# EAGLE design LowVBoard_1.4 (EAGLE 9.6.2)
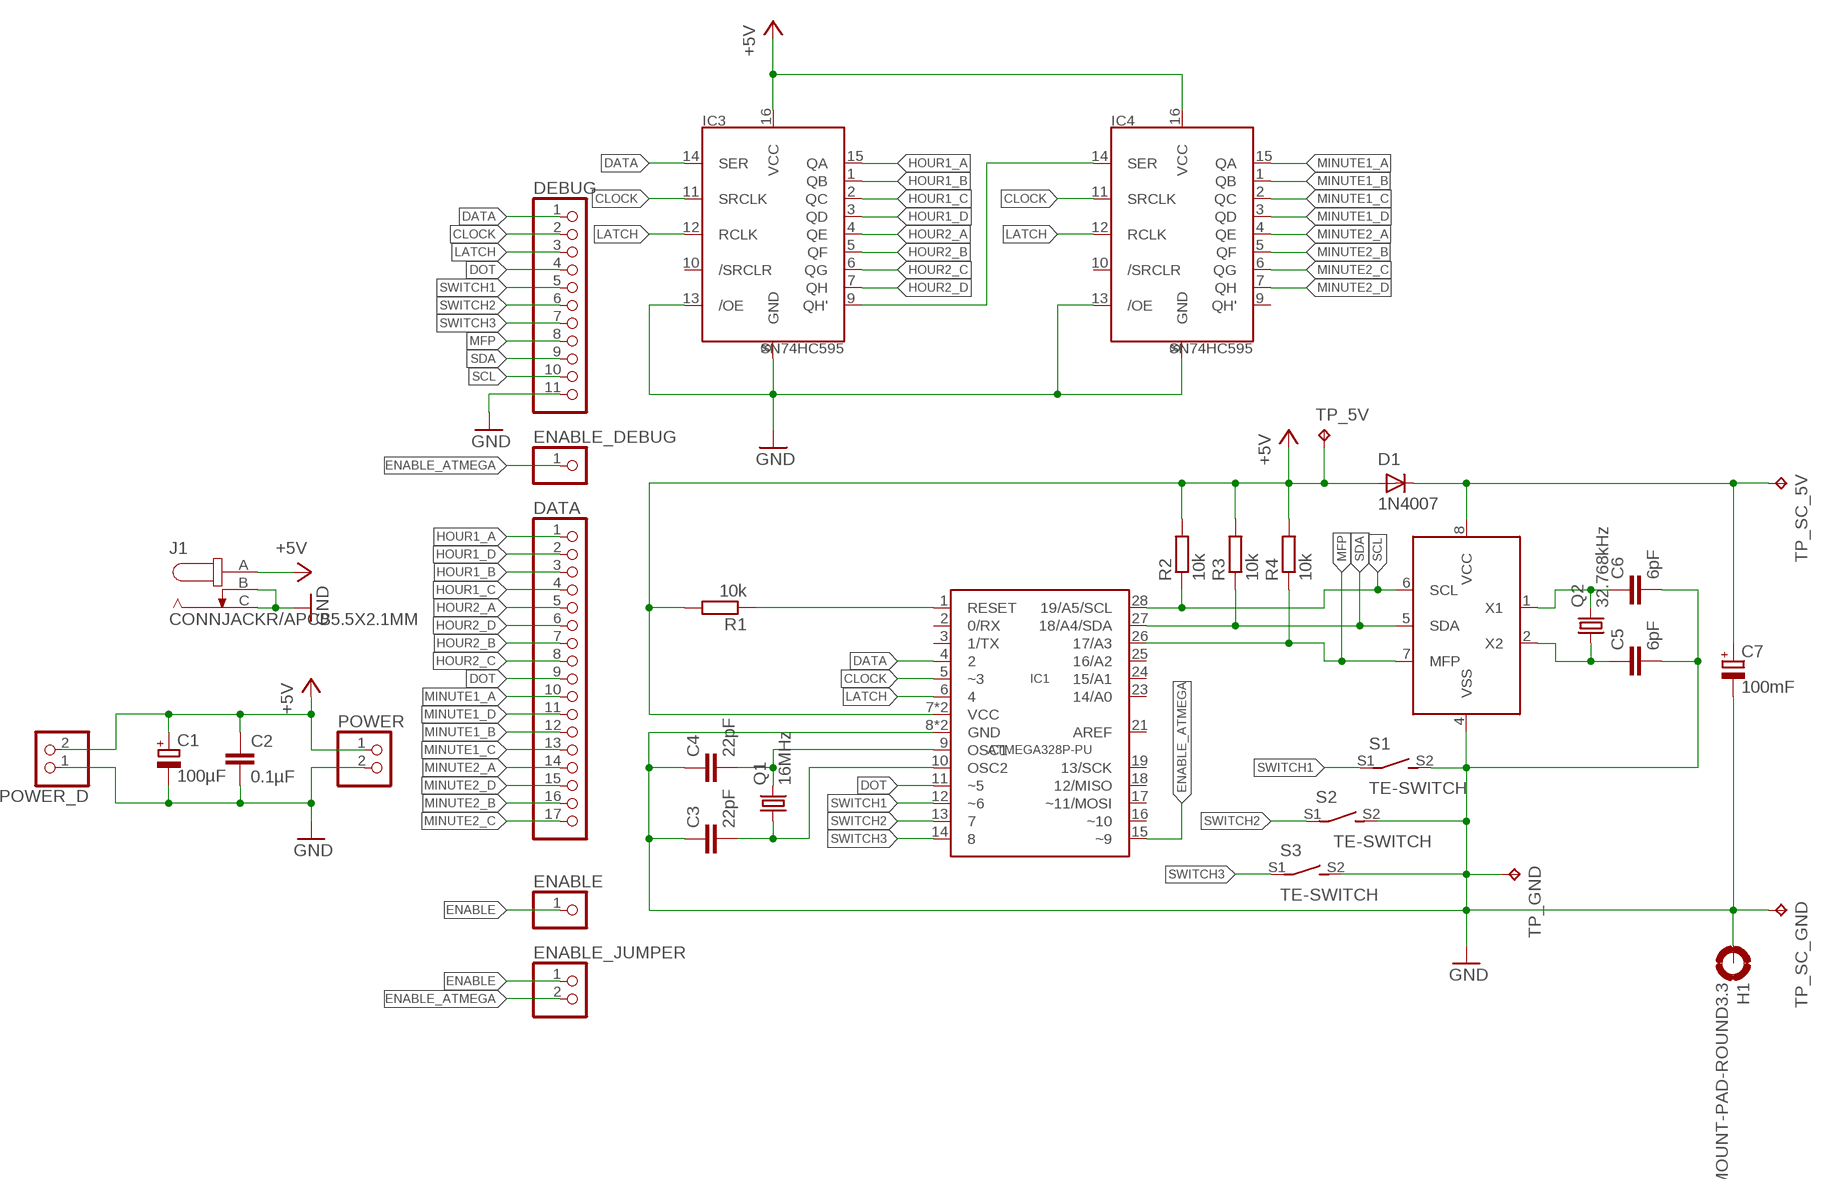
[diagram p0: schematic, sheet 1]

## Parts
C1  100µF  CPOL-EUE2-5  [E2-5]
C2  0.1µF  C-EU025-024X044  [C025-024X044]
C3  22pF  C-EU025-024X044  [C025-024X044]
C4  22pF  C-EU025-024X044  [C025-024X044]
C5  6pF  C-EU025-024X044  [C025-024X044]
C6  6pF  C-EU025-024X044  [C025-024X044]
C7  100mF  FTW0H104ZF  [SUPERCAP-11.5]
D1  1N4007  [DO41-7.6]
DATA  PINHD-1X17  [1X17]
DEBUG  PINHD-1X11/90  [1X11/90]
ENABLE  PINHD-1X1  [1X01]
ENABLE_DEBUG  PINHD-1X1  [1X01]
ENABLE_JUMPER  PINHD-1X2  [1X02]
H1  MOUNT-PAD-ROUND3.3  [3,3-PAD]
IC1  ATMEGA328P-PU  [DIP28]
IC2  MCP7940M  MCP7940M-I/P  [DIL8]
IC3  SN74HC595  [DIL16]
IC4  SN74HC595  [DIL16]
J1  CONNJACKR/APCB5.5X2.1MM  [CONNJACKR/APCB5.5X2.1MM]
POWER  PINHD-1X2  [1X02]
POWER_D  PINHD-1X2/90  [1X02/90]
Q1  16MHz  CRYSTALHC49S  [HC49/S]
Q2  32.768kHz  CFS-206  [CFS-206]
R1  10k  R-EU_0207/7  [0207/7]
R2  10k  R-EU_0207/7  [0207/7]
R3  10k  R-EU_0207/7  [0207/7]
R4  10k  R-EU_0207/7  [0207/7]
S1  TE-SWITCH  [TE-SWITCH]
S2  TE-SWITCH  [TE-SWITCH]
S3  TE-SWITCH  [TE-SWITCH]
TP_5V  TPPAD1-13  [P1-13]
TP_GND  TPPAD1-13  [P1-13]
TP_SC_5V  TPPAD1-13  [P1-13]
TP_SC_GND  TPPAD1-13  [P1-13]

## Nets
+5V [+5V]: C1.+ C2.1 D1.A IC1.7(VCC) IC1.20(VCC) IC3.16(VCC) IC4.16(VCC) J1.A POWER.1 POWER_D.2 R1.2 R2.2 R3.2 R4.2 TP_5V.TP
CLOCK: DEBUG.2 IC1.5(~3) IC3.11(SRCLK) IC4.11(SRCLK)
DATA: DEBUG.1 IC1.4 IC3.14(SER)
DOT: DATA.9 DEBUG.4 IC1.11(~5)
ENABLE: ENABLE.1 ENABLE_JUMPER.1
ENABLE_ATMEGA: ENABLE_DEBUG.1 ENABLE_JUMPER.2 IC1.15(~9)
GND [GND]: C1.- C2.2 C3.1 C4.1 C5.2 C6.2 C7.- DEBUG.11 H1.B3,3(MOUNT) IC1.8(GND) IC1.22(GND) IC2.4(VSS) IC3.8(GND) IC3.13(/OE) IC4.8(GND) IC4.13(/OE) J1.B J1.C POWER.2 POWER_D.1 S1.S2(S) S2.S2(S) S3.S2(S) TP_GND.TP TP_SC_GND.TP
HOUR1_A: DATA.1 IC3.15(QA)
HOUR1_B: DATA.3 IC3.1(QB)
HOUR1_C: DATA.4 IC3.2(QC)
HOUR1_D: DATA.2 IC3.3(QD)
HOUR2_A: DATA.5 IC3.4(QE)
HOUR2_B: DATA.7 IC3.5(QF)
HOUR2_C: DATA.8 IC3.6(QG)
HOUR2_D: DATA.6 IC3.7(QH)
LATCH: DEBUG.3 IC1.6 IC3.12(RCLK) IC4.12(RCLK)
MFP: DEBUG.8 IC1.26(17/A3) IC2.7(MFP) R4.1
MINUTE1_A: DATA.10 IC4.15(QA)
MINUTE1_B: DATA.12 IC4.1(QB)
MINUTE1_C: DATA.13 IC4.2(QC)
MINUTE1_D: DATA.11 IC4.3(QD)
MINUTE2_A: DATA.14 IC4.4(QE)
MINUTE2_B: DATA.16 IC4.5(QF)
MINUTE2_C: DATA.17 IC4.6(QG)
MINUTE2_D: DATA.15 IC4.7(QH)
N$1: C7.+ D1.C IC2.8(VCC) TP_SC_5V.TP
N$53: C4.2 IC1.9(OSC1) Q1.2
N$54: C3.2 IC1.10(OSC2) Q1.1
N$56: IC1.1(RESET) R1.1
N$60: C6.1 IC2.1(X1) Q2.P$2
N$61: C5.1 IC2.2(X2) Q2.P$1
N$69: IC3.9(QH') IC4.14(SER)
SCL: DEBUG.10 IC1.28(19/A5/SCL) IC2.6(SCL) R2.1
SDA: DEBUG.9 IC1.27(18/A4/SDA) IC2.5(SDA) R3.1
SWITCH1: DEBUG.5 IC1.12(~6) S1.S1(P)
SWITCH2: DEBUG.6 IC1.13 S2.S1(P)
SWITCH3: DEBUG.7 IC1.14 S3.S1(P)
Unconnected: IC1.2(0/RX) IC1.3(1/TX) IC1.16(~10) IC1.17(~11/MOSI) IC1.18(12/MISO) IC1.19(13/SCK) IC1.21(AREF) IC1.23(14/A0) IC1.24(15/A1) IC1.25(16/A2) IC3.10(/SRCLR) IC4.9(QH') IC4.10(/SRCLR)

## Library data of the parts
C1 = resistor:CPOL-EU: POLARIZED CAPACITOR, European symbol
C2-C6 = resistor:C-EU: CAPACITOR, European symbol
C7 = Nixie:FTW0H104ZF
D1 = Nixie:1N4007
DATA = pinhead:PINHD-1X17: PIN HEADER
DEBUG = pinhead:PINHD-1X11: PIN HEADER
ENABLE ENABLE_DEBUG = pinhead:PINHD-1X1: PIN HEADER
ENABLE_JUMPER POWER POWER_D = pinhead:PINHD-1X2: PIN HEADER
H1 = holes:MOUNT-PAD-ROUND: MOUNTING PAD, round
IC1 = Programmer:ATMEGA328P-PU
IC2 = Nixie:MCP7940M-I/P
IC3 IC4 = Nixie:SN74HC595
J1 = Nixie:CONNJACKR/APCB5.5X2.1MM
Q1 = crystal:CRYSTAL: CRYSTAL; OC_FARNELL: 1667008; OC_NEWARK: unknown
Q2 = Nixie:CFS-206
R1-R4 = resistor:R-EU_: RESISTOR, European symbol
S1-S3 = Nixie:TE-SWITCH
TP_5V TP_GND TP_SC_5V TP_SC_GND = testpad:TP: Test pad

## Net classes
0 SIGNAL: width 0.203 mm, clearance 0.203 mm
1 +5V: width 0.406 mm, clearance 0.203 mm
2 GND: clearance 0.203 mm

## Board
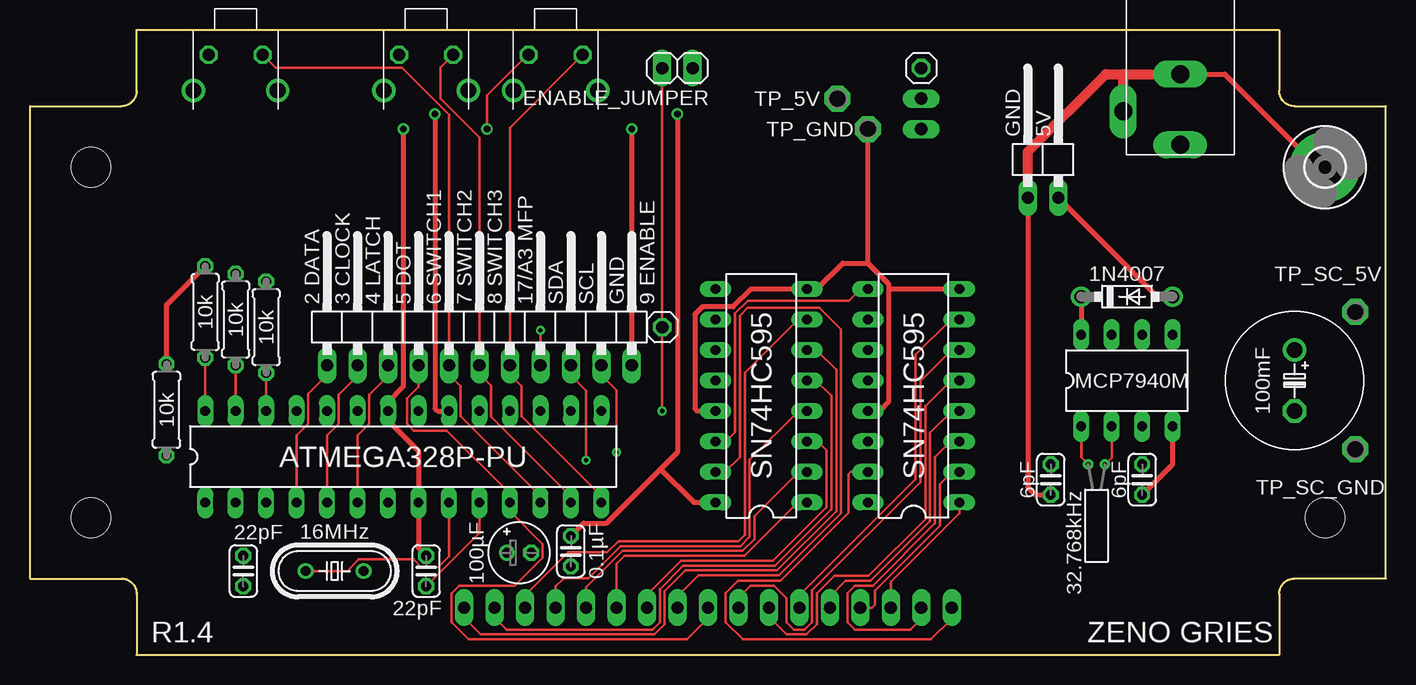
[diagram p1: board, top side]
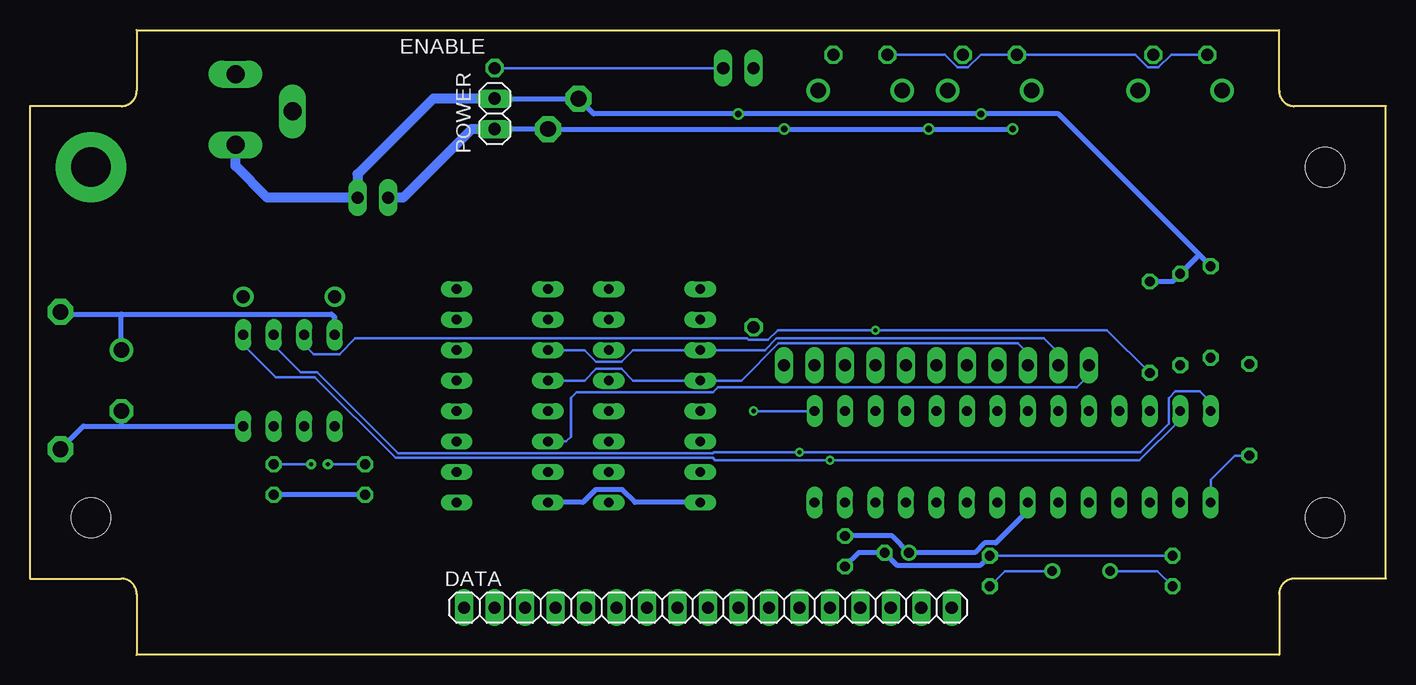
[diagram p2: board, bottom side, seen from below]

Size 113.03 x 52.07 mm. Coordinates in mm from the lower left corner, seen from the top.
Outline: 0,6.35 0,45.72 7.62,45.72 arc90 8.89,46.99 8.89,52.07 104.14,52.07 104.14,46.99 arc90 105.41,45.72 113.03,45.72 113.03,6.35 105.41,6.35 arc90 104.14,5.08 104.14,0 8.89,0 8.89,5.08 arc90 7.62,6.35 0,6.35
Copper layers (1*16): Top 0.035mm / dielectric 1.5mm / Bottom 0.035mm
Design rules "default *": minimum track width 6mil, minimum drill 0.35mm, track to track 6mil, track to pad 6mil, pad to pad 6mil, via to via 6mil, smd to smd 6mil, copper to edge 40mil, drill to drill 6mil, minimum pad ring 10mil, minimum via ring 8mil, stop-mask expansion 4mil, vias tented up to drill 14mil, thermal gap 10mil
Holes 3.3 mm at 5.08,40.64 5.08,11.43 107.95,11.43

### Footprints (pad centres in the part's own frame; a part is rotated, then mirrored left to right if it is on the bottom)
E2-5 = drill 0.813 pad 1.27: + -1.016,0 | drill 0.813 pad 1.27 octagon: - 1.016,0
C025-024X044 = drill 0.813 octagon: 1 -1.27,0; 2 1.27,0
SUPERCAP-11.5 = drill 1.3: + -2.54,0 | drill 1.3 octagon: - 2.54,0
DO41-7.6 = drill 1.1 pad 1.7: A 3.81,0; C -3.81,0
1X17 = drill 1.016 long: 1 -20.32,0; 2 -17.78,0; 3 -15.24,0; 4 -12.7,0; 5 -10.16,0; 6 -7.62,0; 7 -5.08,0; 8 -2.54,0; 9 0,0; 10 2.54,0; 11 5.08,0; 12 7.62,0; 13 10.16,0; 14 12.7,0; 15 15.24,0; 16 17.78,0; 17 20.32,0
1X11/90 = drill 1.016 long: 1 -12.7,-3.81; 2 -10.16,-3.81; 3 -7.62,-3.81; 4 -5.08,-3.81; 5 -2.54,-3.81; 6 0,-3.81; 7 2.54,-3.81; 8 5.08,-3.81; 9 7.62,-3.81; 10 10.16,-3.81; 11 12.7,-3.81
1X01 = drill 1.016 octagon: 1 0,0
1X02 = drill 1.016 long: 1 -1.27,0; 2 1.27,0
3,3-PAD = drill 3.3 pad 5.842: B3,3 0,0
DIP28 = drill 0.813 long: 1 -16.51,-3.81; 2 -13.97,-3.81; 3 -11.43,-3.81; 4 -8.89,-3.81; 5 -6.35,-3.81; 6 -3.81,-3.81; 7 -1.27,-3.81; 8 1.27,-3.81; 9 3.81,-3.81; 10 6.35,-3.81; 11 8.89,-3.81; 12 11.43,-3.81; 13 13.97,-3.81; 14 16.51,-3.81; 15 16.51,3.81; 16 13.97,3.81; 17 11.43,3.81; 18 8.89,3.81; 19 6.35,3.81; 20 3.81,3.81; 21 1.27,3.81; 22 -1.27,3.81; 23 -3.81,3.81; 24 -6.35,3.81; 25 -8.89,3.81; 26 -11.43,3.81; 27 -13.97,3.81; 28 -16.51,3.81
DIL8 = drill 0.813 long: 1 -3.81,-3.81; 2 -1.27,-3.81; 3 1.27,-3.81; 4 3.81,-3.81; 5 3.81,3.81; 6 1.27,3.81; 7 -1.27,3.81; 8 -3.81,3.81
DIL16 = drill 0.813 long: 1 -8.89,-3.81; 2 -6.35,-3.81; 3 -3.81,-3.81; 4 -1.27,-3.81; 5 1.27,-3.81; 6 3.81,-3.81; 7 6.35,-3.81; 8 8.89,-3.81; 9 8.89,3.81; 10 6.35,3.81; 11 3.81,3.81; 12 1.27,3.81; 13 -1.27,3.81; 14 -3.81,3.81; 15 -6.35,3.81; 16 -8.89,3.81
CONNJACKR/APCB5.5X2.1MM = drill 1.5 long: A 0,6.4; B 0,0.5; C 4.75,3.6
1X02/90 = drill 1.016 long: 1 -1.27,-3.81; 2 1.27,-3.81
HC49/S = drill 0.813: 1 -2.413,0; 2 2.413,0
CFS-206 = drill 0.35: P$1 0,-0.7; P$2 0,0.7
0207/7 = drill 0.813 octagon: 1 -3.81,0; 2 3.81,0
TE-SWITCH = drill 1.3: A1 -3.505,1.49; A2 3.505,1.49 | drill 0.99 octagon: S1 -2.25,-1.49; S2 2.25,-1.49
P1-13 = drill 1.321 pad 2.159 octagon: TP 0,0

### Placement (x,y rotation side)
C1  40.77,8.51 0 top
C2  45.09,8.64 270 top
C3  33.02,6.99 270 top
C4  17.78,6.99 270 top
C5  92.71,14.61 270 top
C6  85.09,14.61 270 top
C7  105.41,22.86 270 top
D1  91.44,29.84 0 top
DATA  56.52,3.94 0 bottom
DEBUG  37.47,27.94 0 top
ENABLE  74.3,48.9 0 top
ENABLE_DEBUG  52.7,27.3 0 top
ENABLE_JUMPER  53.98,48.9 180 top
H1  107.95,40.64 0 top
IC1  31.11,16.51 0 top
IC2  91.44,22.86 0 top
IC3  73.66,21.59 90 top
IC4  60.96,21.59 90 top
J1  95.89,48.9 180 top
POWER  74.3,45.09 270 bottom
POWER_D  84.45,41.91 0 top
Q1  25.4,6.99 180 top
Q2  88.9,15.88 90 top
R1  11.38,20.42 90 top
R2  14.61,28.57 90 top
R3  17.14,27.94 90 top
R4  19.68,27.3 90 top
S1  17.14,48.51 180 top
S2  33.02,48.51 180 top
S3  43.81,48.51 180 top
TP_5V  67.31,46.35 0 top
TP_GND  69.85,43.81 0 top
TP_SC_5V  110.49,28.57 0 top
TP_SC_GND  110.49,17.14 0 top

### Tracks (layer width: path | path; a pad name or v marks a point on that pad's centre or on a via)
+5V  (via drill 0.55)
  Top 0.406: IC1.20 33.98,20.32 33.76,20.55 v33.76,45.09 | R1.2 11.38,29.16 R2.2 | POWER_D.2 93.98,29.84 D1.A | v53.98,45.09 53.98,16.88 52.57,15.48 | IC4.16 55.35,12.7 52.57,15.48 | C2.1 46.15,10.97 48.07,10.97 52.57,15.48
  Bottom 0.406: POWER.1 TP_5V.TP 66.04,45.09 v53.98,45.09 v33.76,45.09 27.3,45.09 15.56,33.34 | R2.2 15.56,33.34 | R4.2 17.78,31.11 R3.2 15.56,33.34 | IC1.7 29.84,11.99 32.51,9.32 33.46,9.32 34.27,8.51 C1.+ 41.15,9.91 C2.1 | IC4.16 62.6,12.7 63.67,13.77 65.87,13.77 66.94,12.7 IC3.16
  Bottom 0.813: J1.A 95.89,40.74 93.24,38.1 POWER_D.2 85.72,40.06 79.43,46.35 POWER.1
CLOCK
  Top 0.203: IC1.5 24.77,18.3 25.73,19.26 25.73,21.69 27.3,23.27 DEBUG.2
  Bottom 0.203: DEBUG.2 27.3,25.18 28.49,26.36 50.79,26.36 51.76,25.4 IC4.11 62.74,25.4 63.71,24.43 65.84,24.43 66.8,25.4 IC3.11
DATA
  Top 0.203: IC1.4 22.23,18.3 23.19,19.26 23.19,21.77 24.77,23.34 DEBUG.1
  Bottom 0.203: DEBUG.1 24.77,23.31 25.77,22.3 55.67,22.3 56.07,21.89 67.49,21.89 67.94,21.44 67.94,18.16 68.33,17.78 IC3.14
DOT
  Top 0.203: DEBUG.4 32.38,22.34 31.42,21.38 31.42,19.26 31.98,18.69 34.75,18.69 40.01,13.44 IC1.11 40.01,11.96 42.75,9.22 42.75,8.11 40.41,5.77 35.75,5.77 35.13,5.14 35.13,2.73 36.57,1.29 54.77,1.29 56.52,3.04 DATA.9
ENABLE
  Bottom 0.203: ENABLE_JUMPER.1 ENABLE.1
ENABLE_ATMEGA  (via drill 0.35)
  Top 0.203: v52.7,20.32 ENABLE_DEBUG.1 ENABLE_JUMPER.2
  Bottom 0.203: IC1.15 v52.7,20.32
GND  (via drill 0.55)
  Top 0.203: S3.S2 41.48,50.01 38.1,46.62 v38.1,43.81
  Top 0.406: H1.B3,3 107.34,40.64 99.59,48.4 J1.B | v31.11,43.81 31.11,22.38 29.84,21.11 IC1.22 29.84,19.51 32.38,16.97 IC1.8 32.38,8.89 C3.1 | POWER_D.1 83.19,13.97 83.82,13.34 C6.2 | C5.2 95.25,15.88 IC2.4 | 69.85,32.65 71.58,30.92 71.58,30.48 | IC3.13 70.8,20.32 71.58,21.1 71.58,30.48 | IC4.13 55.64,20.32 55.42,20.54 55.42,28.38 56.05,29.01 58.62,29.01 60.09,30.48 IC4.8 65.58,30.48 67.75,32.65 69.85,32.65 | IC3.8 71.58,30.48 | 69.85,32.65 TP_GND.TP | v50.16,43.81 DEBUG.11 | 91.14,48.4
  Top 0.813: POWER_D.1 83.19,41.91 89.67,48.4 91.14,48.4 | 91.14,48.4 J1.B | J1.C 91.14,48.4
  Bottom 0.203: S1.S2 17.91,50.01 18.96,48.95 19.83,48.95 20.89,50.01 S2.S2 33.78,50.01 34.83,48.95 35.71,48.95 36.76,50.01 S3.S2 | C3.1 C4.1
  Bottom 0.406: POWER.2 TP_GND.TP v50.16,43.81 v38.1,43.81 v31.11,43.81 | C2.2 43.94,8.51 C1.- 40.72,7.44 33.84,7.44 33.03,8.26 C3.1 | C6.2 C5.2 | TP_SC_GND.TP 108.58,19.05 105.41,19.05 | 105.41,19.05 IC2.4 | C7.- 105.41,19.05
  Bottom 0.813: POWER.2 76.22,43.81 81.94,38.1 POWER_D.1
HOUR1_A
  Top 0.203: IC3.15 68.43,15.24 68.22,15.03 68.22,11.83 62.57,6.17 59.02,6.17 57.99,5.14 57.99,2.73 59.43,1.29 75.12,1.29 76.83,3.01 DATA.1
HOUR1_B
  Top 0.203: DATA.3 71.75,6.07 77.47,11.79 IC3.1
HOUR1_C
  Top 0.203: IC3.2 76.86,15.24 75.84,14.22 75.84,10.76 70.43,5.35 70.43,4.19 70.18,3.94 DATA.4
HOUR1_D
  Top 0.203: IC3.3 76.76,17.78 75.44,16.46 75.44,10.95 70.26,5.77 68.77,5.77 68.15,5.14 68.15,2.73 68.77,2.11 73.41,2.11 74.3,3 DATA.2
HOUR2_A
  Top 0.203: IC3.4 76.86,20.32 75.03,18.49 75.03,11.12 70.08,6.17 68,6.17 66.67,4.85 DATA.5
HOUR2_B
  Top 0.203: IC3.5 76.78,22.86 74.62,20.7 74.62,11.3 69.9,6.58 67.05,6.58 65.61,5.14 65.61,2.56 64.75,1.7 63.07,1.7 61.59,3.17 DATA.7
HOUR2_C
  Top 0.203: IC3.6 76.81,25.4 74.22,22.81 74.22,14.39 65.2,5.37 65.2,2.73 64.58,2.11 63.69,2.11 63.07,2.73 63.07,4.73 62.04,5.77 60.07,5.77 59.05,4.75 DATA.8
HOUR2_D
  Top 0.203: IC3.7 76.76,27.94 73.81,24.99 73.81,14.63 64.14,4.95 DATA.6
LATCH
  Top 0.203: IC1.6 27.3,18.3 28.27,19.26 28.27,21.69 29.84,23.27 DEBUG.3
  Bottom 0.203: DEBUG.3 29.84,25.13 30.67,25.96 50.62,25.96 53.72,22.86 IC4.12 62.74,22.86 63.71,23.82 65.83,23.82 66.8,22.86 IC3.12
MFP  (via drill 0.35)
  Top 0.203: IC1.26 R4.1 | v42.55,27.05 DEBUG.8
  Bottom 0.203: R4.1 23.24,27.05 v42.55,27.05 50.68,27.05 51.49,26.24 53.15,26.24 53.27,26.36 85.91,26.36 87.23,25.04 89.38,25.04 90.17,25.83 IC2.7
MINUTE1_A
  Top 0.203: DATA.10 53.98,4.88 55.73,6.63 62.45,6.63 67.61,11.79 67.61,27.12 65.83,28.91 59.82,28.91 59.18,28.26 59.18,16.48 57.94,15.24 IC4.15
MINUTE1_B
  Top 0.203: DATA.12 48.9,7.59 49.55,8.26 59.58,8.26 64.02,12.7 IC4.1
MINUTE1_C
  Top 0.203: IC4.2 64.11,15.24 60.4,11.53 60.4,9.65 59.41,8.66 49.39,8.66 46.35,5.63 DATA.13
MINUTE1_D
  Top 0.203: IC4.3 65.68,17.78 66.4,17.06 66.4,12.3 61.94,7.85 54.28,7.85 51.44,5 DATA.11
MINUTE2_A
  Top 0.203: IC4.4 64.06,20.32 59.99,16.26 59.99,9.83 59.23,9.07 49.22,9.07 46.55,6.4 44.5,6.4 43.81,5.71 DATA.14
MINUTE2_B
  Top 0.203: IC4.5 65.53,22.86 66.8,21.58 66.8,12.13 62.11,7.44 54.46,7.44 52.5,5.49 52.5,2.73 51.88,2.11 39.72,2.11 38.73,3.09 DATA.16
MINUTE2_C
  Top 0.203: DATA.17 36.2,3.09 37.58,1.7 52.05,1.7 52.91,2.56 52.91,5.32 54.63,7.04 62.28,7.04 67.21,11.96 67.21,23.74 65.55,25.4 IC4.6
MINUTE2_D
  Top 0.203: IC4.7 64.03,27.94 59.59,23.5 59.59,10.01 59.05,9.47 49.05,9.47 48.11,8.53 44.85,8.53 41.27,4.96 DATA.15
N$1
  Top 0.406: D1.C IC2.8
  Bottom 0.406: IC2.8 87.63,28.13 87.9,28.4 105.41,28.4 | TP_SC_5V.TP 110.31,28.4 105.41,28.4 | C7.+ 105.41,28.4
N$53
  Top 0.203: Q1.2 26.45,6.99 27.41,7.95 31.96,7.95 32.62,7.29 34,7.29 34.92,8.21 IC1.9
  Bottom 0.203: C4.2 19.05,6.99 Q1.2
N$54
  Top 0.203: C3.2 37.47,10.16 IC1.10
  Bottom 0.203: Q1.1 31.75,6.99 C3.2
N$56
  Bottom 0.203: R1.1 12.57,16.61 14.61,14.58 IC1.1
N$60
  Top 0.203: Q2.P$2 87.63,16.46 IC2.1
  Bottom 0.203: C6.1 Q2.P$2
N$61
  Top 0.203: Q2.P$1 89.61,15.88 90.17,16.43 IC2.2
  Bottom 0.203: Q2.P$1 C5.1
N$69
  Top 0.203: IC4.14 58.01,17.78 58.78,18.54 58.78,28.45 59.84,29.52 68.28,29.52 69.24,30.48 IC3.9
SCL  (via drill 0.35)
  Top 0.203: IC1.28 R2.1 | v48.9,16.89 48.9,22.05 47.62,23.32 DEBUG.10
  Bottom 0.203: IC1.28 14.61,21.02 15.53,21.95 17.55,21.95 18.11,21.38 18.11,19.25 20.47,16.89 v48.9,16.89 56.01,16.89 56.09,16.82 82.35,16.82 89.08,23.55 90.45,23.55 92.71,25.81 IC2.6
SDA  (via drill 0.35)
  Top 0.203: R3.1 IC1.27 | v46.35,16.2 46.35,22.02 45.09,23.29 DEBUG.9
  Bottom 0.203: IC1.27 17.14,19.61 20.55,16.2 v46.35,16.2 55.91,16.2 56.11,16.41 82.55,16.41 89.28,23.14 92.53,23.14 95.25,25.86 IC2.5
SWITCH1
  Top 0.203: IC1.12 42.55,13.21 35.89,19.86 35.89,22.38 34.92,23.34 DEBUG.5 34.92,45.02 31.01,48.94 20.46,48.94 S1.S1
SWITCH2
  Top 0.203: IC1.13 45.09,13.18 38.43,19.84 38.43,22.42 37.47,23.39 DEBUG.6 37.47,43.08 34.21,46.33 34.21,48.95 S2.S1
SWITCH3
  Top 0.203: IC1.14 47.62,13.21 40.97,19.86 40.97,22.4 40.01,23.36 DEBUG.7 40.01,43.94 S3.S1

### Text on the board
tNames: GND | 5V | 2 DATA | 3 CLOCK | 4 LATCH | 5 DOT | 6 SWITCH1 | 7 SWITCH2 | 8 SWITCH3 | 17/A3 MFP | SDA | SCL | GND | 9 ENABLE | R1.4 | ZENO GRIES